# Altium schematic sheet Communication sheet.SchDoc: Rs-485 and I2C
size A; DrawnBy: Mr.Farhad Jafari; Engineer: Mr.Farhad Jafari; Address1: www.BasetP.com; Address2: www.BasetP.com; Address3: www.BasetP.com; Address4: www.BasetP.com; Revision: V1.1; SheetNumber: 2; SheetTotal: 5; ProjectName: Humanoid robot
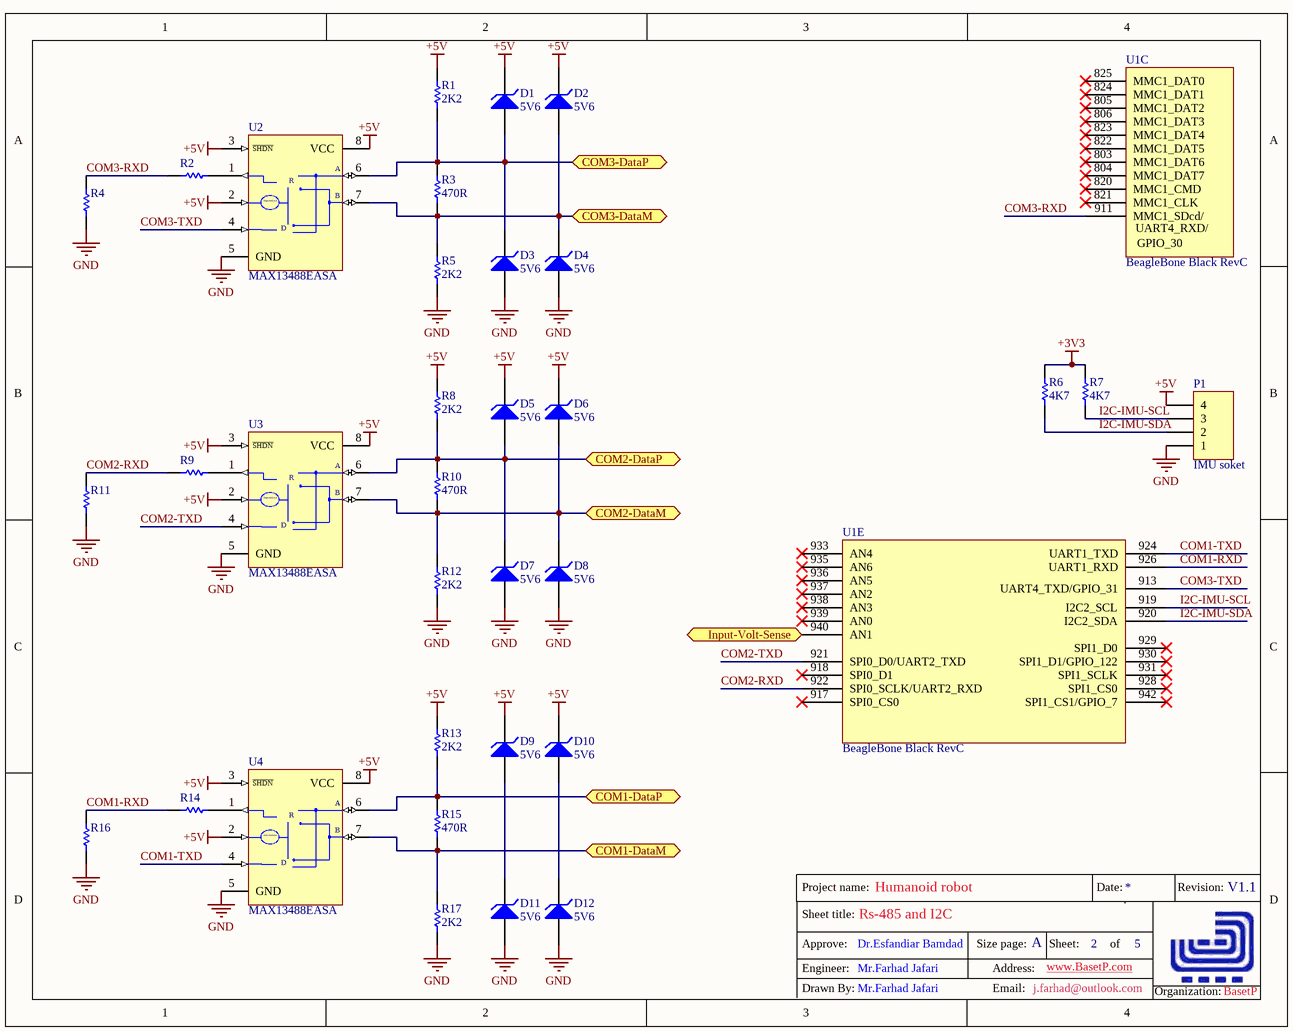
[diagram p0: Communication sheet.SchDoc]

## Parts
D1  5V6  [diode-0.4]
D2  5V6  [diode-0.4]
D3  5V6  [diode-0.4]
D4  5V6  [diode-0.4]
D5  5V6  [diode-0.4]
D6  5V6  [diode-0.4]
D7  5V6  [diode-0.4]
D8  5V6  [diode-0.4]
D9  5V6  [diode-0.4]
D10  5V6  [diode-0.4]
D11  5V6  [diode-0.4]
D12  5V6  [diode-0.4]
P1  IMU soket  [HDR1X4]
R1  2K2  [6-0805]
R2  620  [6-0805]  (value not drawn)
R3  470R  [6-0805]
R4  1K  [6-0805]  (value not drawn)
R5  2K2  [6-0805]
R6  4K7  [6-0805]
R7  4K7  [6-0805]
R8  2K2  [6-0805]
R9  680R  [6-0805]  (value not drawn)
R10  470R  [6-0805]
R11  1K  [6-0805]  (value not drawn)
R12  2K2  [6-0805]
R13  2K2  [6-0805]
R14  680R  [6-0805]  (value not drawn)
R15  470R  [6-0805]
R16  1K  [6-0805]  (value not drawn)
R17  2K2  [6-0805]
U1  BeagleBone Black RevC  [BBB-C]  (parts C,E of 6)
U2  MAX13488EASA  [NSO8_N]
U3  MAX13488EASA  [NSO8_N]
U4  MAX13488EASA  [NSO8_N]

## Ports
COM1-DataM, COM1-DataP, COM2-DataM, COM2-DataP, COM3-DataM, COM3-DataP, Input-Volt-Sense (in)

## Nets
+3V3: R6.1 R7.1
+5V: D1.2(K) D2.2(K) D5.2(K) D6.2(K) D9.2(K) D10.2(K) P1.4 R1.1 R8.1 R13.1 U2.2(~{RE}) U2.3(~{SHDN}) U2.8(VCC) U3.2(~{RE}) U3.3(~{SHDN}) U3.8(VCC) U4.2(~{RE}) U4.3(~{SHDN}) U4.8(VCC)
GND: D3.1(A) D4.1(A) D7.1(A) D8.1(A) D11.1(A) D12.1(A) P1.1 R4.1 R5.2 R11.2 R12.2 R16.1 R17.2 U2.5(GND) U3.5(GND) U4.5(GND)
COM1-DataM: R15.2 R17.1 U4.7(B) ; port COM1-DataM
COM1-DataP: R13.2 R15.1 U4.6(A) ; port COM1-DataP
COM1-RXD: R14.1 R16.2 U1.926(UART1_RXD)
COM1-TXD: U1.924(UART1_TXD) U4.4(DI)
COM2-DataM: D6.1(A) D8.2(K) R10.2 R12.1 U3.7(B) ; port COM2-DataM
COM2-DataP: D5.1(A) D7.2(K) R8.2 R10.1 U3.6(A) ; port COM2-DataP
COM2-RXD: R9.2 R11.1 U1.922(SPI0_SCLK/UART2_RXD)
COM2-TXD: U1.921(SPI0_D0/UART2_TXD) U3.4(DI)
COM3-DataM: D2.1(A) D4.2(K) R3.2 R5.1 U2.7(B) ; port COM3-DataM
COM3-DataP: D1.1(A) D3.2(K) R1.2 R3.1 U2.6(A) ; port COM3-DataP
COM3-RXD: R2.1 R4.2 U1.911(MMC1_SDcd/)
COM3-TXD: U1.913(UART4_TXD/GPIO_31) U2.4(DI)
I2C-IMU-SCL: P1.3 R7.2 U1.919(I2C2_SCL)
I2C-IMU-SDA: P1.2 R6.2 U1.920(I2C2_SDA)
Input-Volt-Sense: U1.940(AN1) ; port Input-Volt-Sense
NetD9_1: D9.1(A) D11.2(K)
NetD10_1: D10.1(A) D12.2(K)
NetR2_2: R2.2 U2.1(RO)
NetR9_1: R9.1 U3.1(RO)
NetR14_2: R14.2 U4.1(RO)

Not connected (* = marked no-connect by the designer): U1 803(MMC1_DAT6)* 804(MMC1_DAT7)* 805(MMC1_DAT2)* 806(MMC1_DAT3)* 820(MMC1_CMD)* 821(MMC1_CLK)* 822(MMC1_DAT5)* 823(MMC1_DAT4)* 824(MMC1_DAT1)* 825(MMC1_DAT0)* 917(SPI0_CS0)* 918(SPI0_D1)* 928(SPI1_CS0)* 929(SPI1_D0)* 930(SPI1_D1/GPIO_122)* 931(SPI1_SCLK)* 933(AN4)* 935(AN6)* 936(AN5)* 937(AN2)* 938(AN3)* 939(AN0)* 942(SPI1_CS1/GPIO_7)*

## Notes on the sheet
- Sheet title:
- Project name:
- Date:
- Revision:
- Engineer:
- Approve:
- Dr.Esfandiar Bamdad
- Size page:
- Address:
- A
- www.BasetP.com
- Sheet:
- of
- Drawn By:
- Mr.Farhad Jafari
- Email:
- j.farhad@outlook.com
- Organization:
- BasetP
- (in symbol BeagleBoneBlackRevC, part C) UART4_RXD/; GPIO_30
- (in symbol MAX13488EASA) R; State machine; D

## Library data of the parts
D1-D12 = D Zener: Zener Diode; Published: 8-Jun-2000; LatestRevisionDate: 17-Jul-2002; LatestRevisionNote: Re-released for DXP Platform.; PackageReference: DIODE-0.7; Publisher: Altium Limited; PackageDescription: Diode, Thru-Hole; 2 Leads; 0.7 in Pin Spacing
P1 = Header 4: Header, 4-Pin; LatestRevisionDate: 17-Jul-2002; LatestRevisionNote: Re-released for DXP Platform.; Publisher: Altium Limited
R1-R17 = ERJ6RS: Low Ohmic Value Thick Film Chip Resistor, 0.1 Ohm to 0.2 Ohm Range, 1%, 2% and 5% Tolerance, 0805 Size, 0.125 W; Published: 17-Dec-2003; LatestRevisionDate: 19-Mar-2004; LatestRevisionNote: Silkscreen size reduced.; PackageDocument: Mar-2003; PackageReference: 6-0805; Publisher: Altium Limited; Code_IPC: 2012 [0805]; ComponentLink1Description: Manufacturer Link; ComponentLink1URL: http://www.panasonic.com/industrial/components/resistive_products.htm; ComponentLink2Description: Datasheet; ComponentLink2URL: http://www.panasonic.com/industrial/components/pdf/AOA0000CE3.pdf
U1 = BeagleBoneBlackRevC
U2-U4 = MAX13488EASA: Low-Power,  RS-485/RS-422 Transceiver, Auto direciton; Published: 7-May-2015; LatestRevisionNote: IPC-7351 Footprint Added.; PackageReference: NSO8; Publisher: Farhad Jafari; PackageDescription: 8-Pin Small Outline Integrated Circuit 1.27 mm Pitch; Code_JEDEC: MS-012-AA; Code_IPC: SOIC127P600-8; ComponentLink1Description: Manufacturer Link; ComponentLink1URL: http://www.maxim-ic.com/